# EAGLE design Schaltplan_VoltageLevelShifter (EAGLE 6.4)
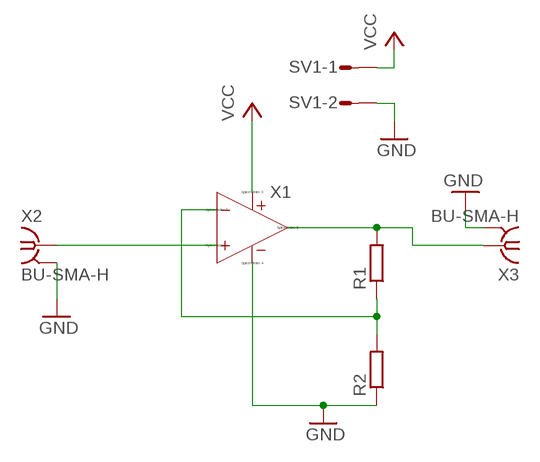
[diagram p0: schematic, sheet 1]

## Parts
R1  R-EU_0204/7  [0204/7]
R2  R-EU_0204/7  [0204/7]
SV1  S02P  [S02P]
X1  UNIVERSALOPAMP2  [S8]
X2  BU-SMA-H  [BU-SMA-H]
X3  BU-SMA-H  [BU-SMA-H]

## Nets
GND: R2.1 SV1.2 X1.4(V-) X2.2 X2.3 X2.4 X2.5 X3.2 X3.3 X3.4 X3.5
N$1: X1.1(IN+) X2.1
N$2: R1.2 X1.3(OUT) X3.1
N$3: R1.1 R2.2 X1.2(IN-)
VCC: SV1.1 X1.8(V+)

## Library data of the parts
R1 R2 = rcl:R-EU_: RESISTOR, European symbol
SV1 = con-amp-mt:S02P: AMP MT CONNECTOR; OC_FARNELL: unknown; OC_NEWARK: unknown
X1 = Opamps:UNIVERSALOPAMP2: Universal Opamp model that allows 4 different levels of simulation accuracy. See ./examples/Educational/UniversalOpamp2.asc for details. En and in are equivalent voltage and current noises. Enk and ink are the respective corner frequencies. Phimargin is used to set the 2nd pole or delay to the approximate phase margin for level.3a and level.3b. This version uses the new, experimental level 2 switch as the output devices.
X2 X3 = con-coax:BU-SMA-H: FEMALE SMA CONNECTOR Radiall; OC_FARNELL: unknown; OC_NEWARK: unknown

## Board
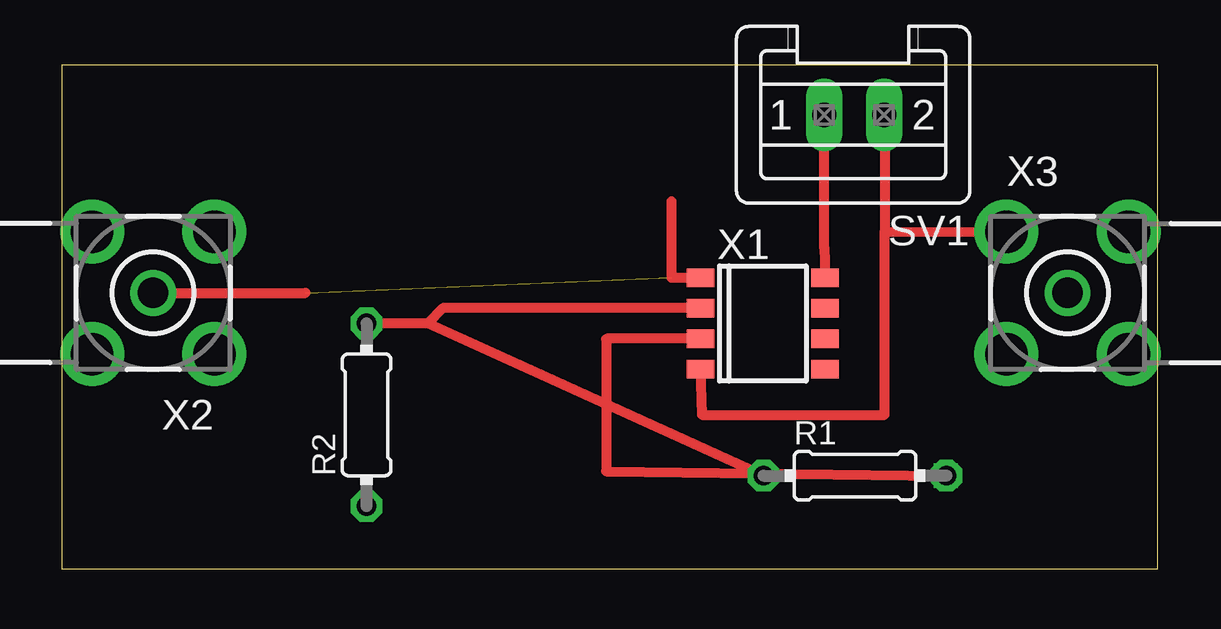
[diagram p1: board, top side]
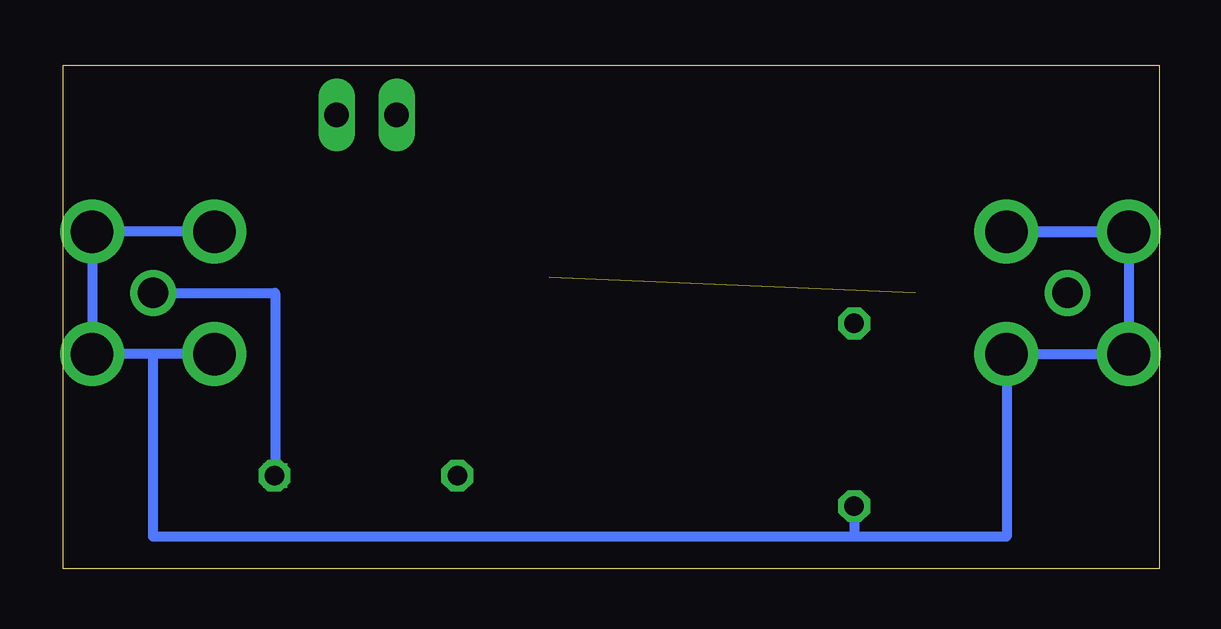
[diagram p2: board, bottom side, seen from below]

Size 45.66 x 21.01 mm. Coordinates in mm from the lower left corner, seen from the top.
Outline: 0,0 45.66,0 45.66,21.01 0,21.01 0,0
Copper layers (1*16): Top 0.035mm / dielectric 1.5mm / Bottom 0.035mm
Design rules "default": minimum track width 10mil, minimum drill 24mil, track to track 8mil, track to pad 8mil, pad to pad 8mil, via to via 8mil, smd to smd 8mil, copper to edge 40mil, drill to drill 8mil, minimum pad ring 10mil, minimum via ring 8mil, stop-mask expansion 4mil, vias tented up to drill 0mil, thermal gap 10mil

### Footprints (pad centres in the part's own frame; a part is rotated, then mirrored left to right if it is on the bottom)
0204/7 = drill 0.813 octagon: 1 -3.81,0; 2 3.81,0
S02P = drill 1.016 long: 1 1.25,0; 2 -1.25,0
S8 = smd 0.762 x 1.143: 1 -1.905,-2.6; 2 -0.635,-2.6; 3 0.635,-2.6; 4 1.905,-2.6; 5 1.905,2.6; 6 0.635,2.6; 7 -0.635,2.6; 8 -1.905,2.6
BU-SMA-H = drill 1.27: 1 0,0 | drill 1.778: 2 -2.55,2.55; 3 2.55,2.55; 4 2.55,-2.55; 5 -2.55,-2.55

### Placement (x,y rotation side)
R1  33.05,3.89 0 top
R2  12.7,6.43 90 top
SV1  33.02,18.94 180 top
X1  29.21,10.24 270 top
X2  3.81,11.51 180 top
X3  41.91,11.51 0 top

### Tracks (layer width: path | path; a pad name or v marks a point on that pad's centre or on a via)
GND
  Top 0.406: SV1.2 34.29,18.67 34.29,14.05 | 34.29,14.05 X3.2 | X1.4 26.67,6.43 34.29,6.43 34.29,14.05
  Bottom 0.406: X3.5 41.91,8.96 | 41.91,8.96 X3.4 X3.3 X3.2 | X2.4 X2.5 X2.4 X2.3 X2.2 6.35,1.35 12.7,1.35 | R2.1 12.7,1.35 | 12.7,1.35 41.91,1.35 41.91,8.96
N$1  (1 unrouted)
  Top 0.406: 25.4,15.32 25.4,12.14 X1.1 | X2.1 10.16,11.51
N$2  (via drill 0.6)
  Top 0.406: X1.3 22.71,9.61 22.68,9.57 22.68,4.07 R1.2
  Bottom 0.406: R1.2 v36.83,3.89 36.83,11.51 X3.1
N$3
  Top 0.406: R1.1 15.24,10.24 | 15.24,10.24 R2.2 | X1.2 15.88,10.88 15.24,10.24
VCC
  Top 0.406: SV1.1 31.77,13.41 X1.8